# EAGLE design AP_AT42QT2120 (EAGLE 9.6.2)
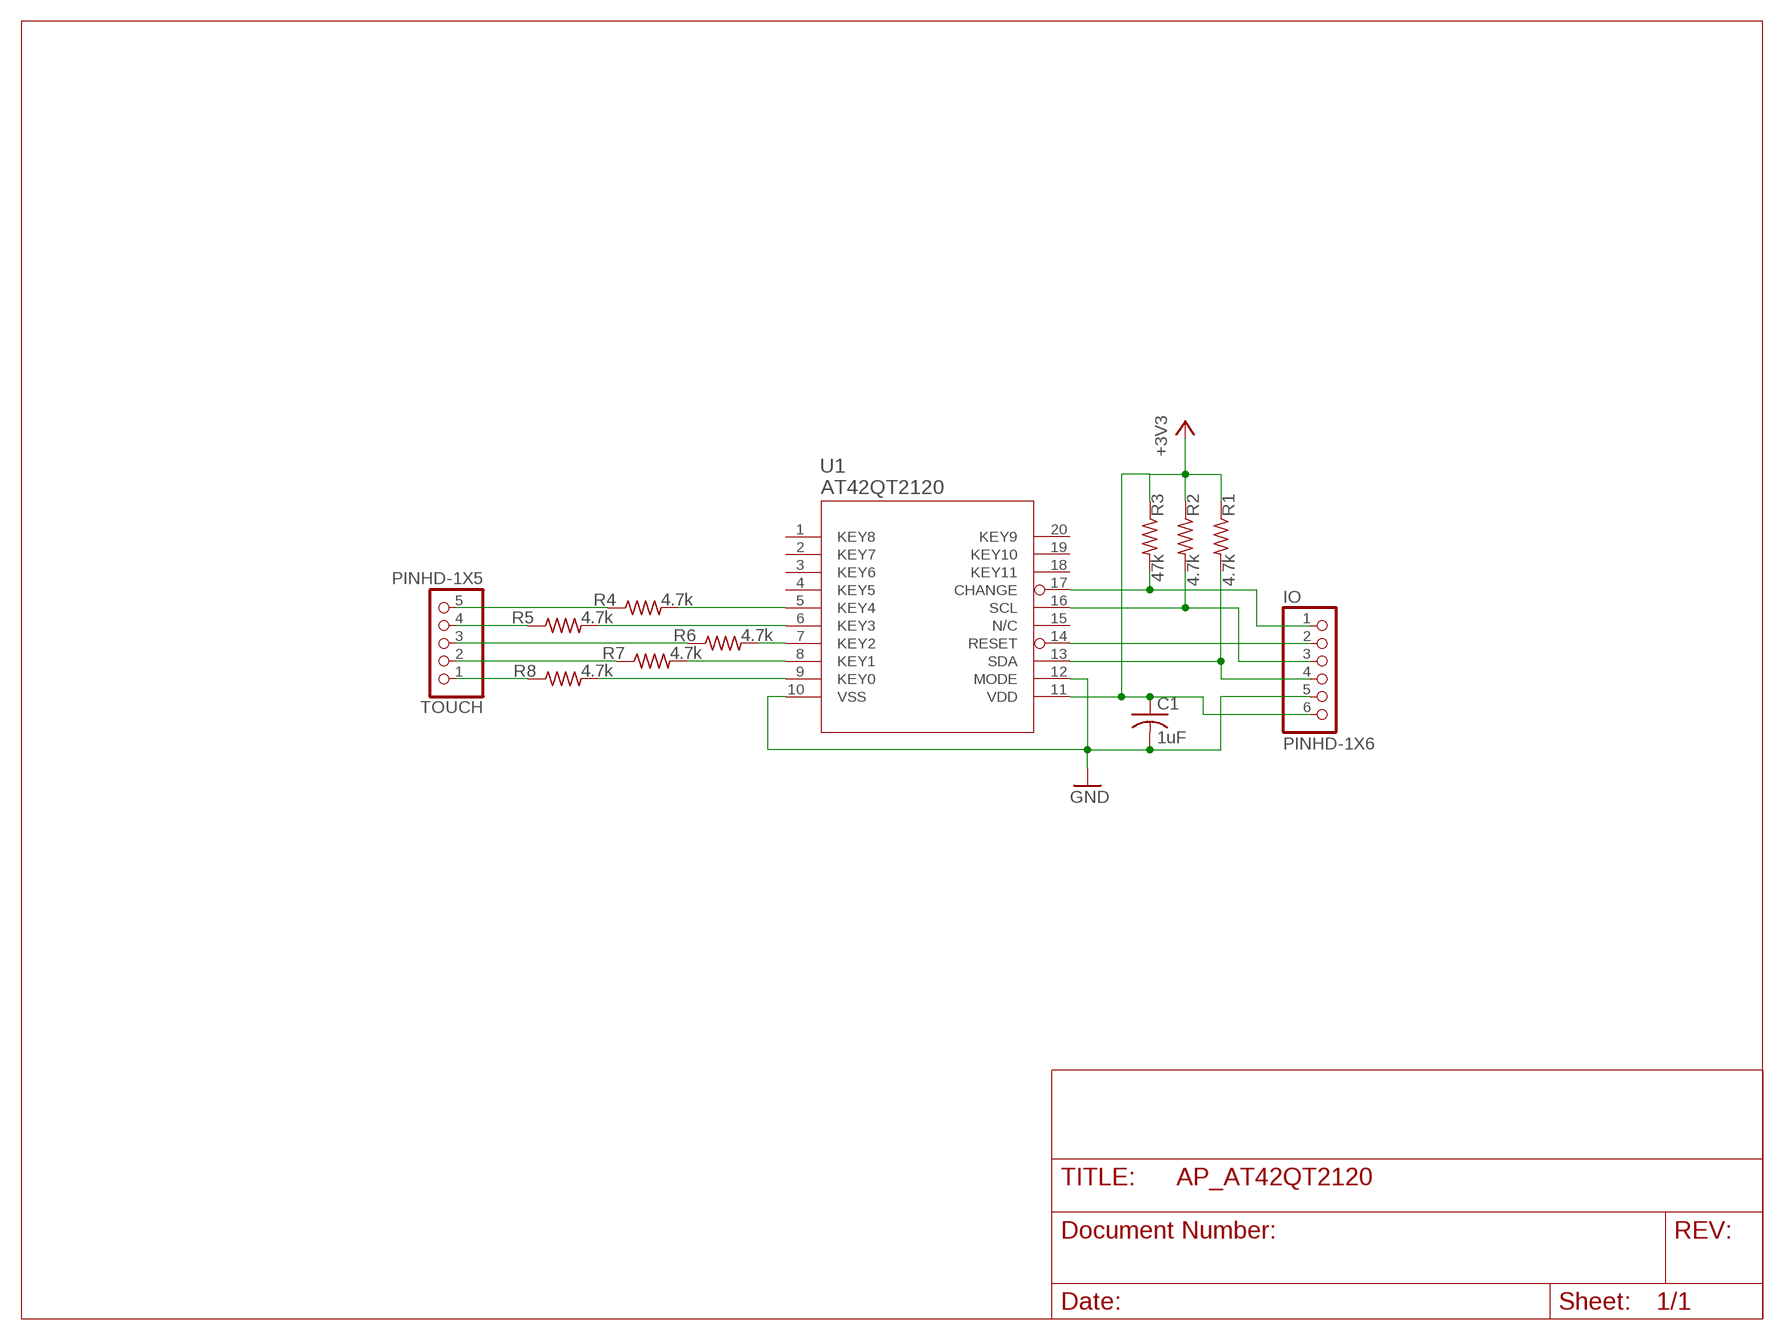
[diagram p0: schematic, sheet 1]

## Parts
C1  1uF  C-USC1206  [C1206]
IO  PINHD-1X6  [1X06]
R1  4.7k  R-US_R1206  [R1206]
R2  4.7k  R-US_R1206  [R1206]
R3  47k  R-US_R1206  [R1206]
R4  4.7k  R-US_R1206  [R1206]
R5  4.7k  R-US_R1206  [R1206]
R6  4.7k  R-US_R1206  [R1206]
R7  4.7k  R-US_R1206  [R1206]
R8  4.7k  R-US_R1206  [R1206]
TOUCH  PINHD-1X5  [1X05]
U1  AT42QT2120  AT42QT2120-SU  [SOIC20]

## Nets
+3V3: C1.1 IO.6 R1.1 R2.1 R3.1 U1.11(VDD)
GND: C1.2 IO.5 U1.10(VSS) U1.12(MODE)
N$1: IO.2 U1.14(RESET)
N$2: R5.1 TOUCH.4
N$5: R4.2 U1.5(KEY4)
N$6: R5.2 U1.6(KEY3)
N$7: R6.2 U1.7(KEY2)
N$8: R7.2 U1.8(KEY1)
N$9: R8.2 U1.9(KEY0)
N$10: R8.1 TOUCH.1
N$11: R7.1 TOUCH.2
N$12: R6.1 TOUCH.3
N$14: R4.1 TOUCH.5
N$25: IO.3 R2.2 U1.16(SCL)
N$26: IO.1 R3.2 U1.17(CHANGE)
N$27: IO.4 R1.2 U1.13(SDA)
Unconnected: U1.1(KEY8) U1.2(KEY7) U1.3(KEY6) U1.4(KEY5) U1.15(N/C) U1.18(KEY11) U1.19(KEY10) U1.20(KEY9)

## Library data of the parts
C1 = rcl:C-US: CAPACITOR, American symbol; SPICEPREFIX: C
IO = Connector:PINHD-1X6: PIN HEADER; CATEGORY: CONNECTOR; SUB-CATEGORY: PIN-HEADER
R1-R8 = rcl:R-US_: RESISTOR, American symbol; SPICEPREFIX: R
TOUCH = Connector:PINHD-1X5: PIN HEADER; CATEGORY: CONNECTOR; SUB-CATEGORY: PIN-HEADER
U1 = 2022-03-29_19-48-10_Library:AT42QT2120-SU: COMMS NAMES

## Board
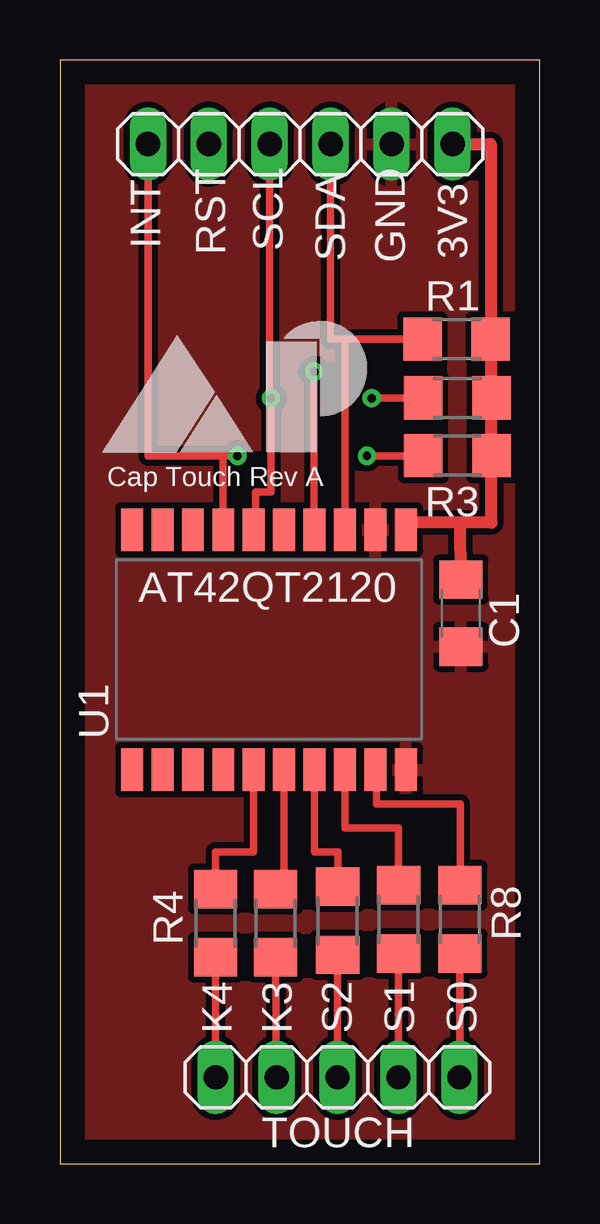
[diagram p1: board, top side]
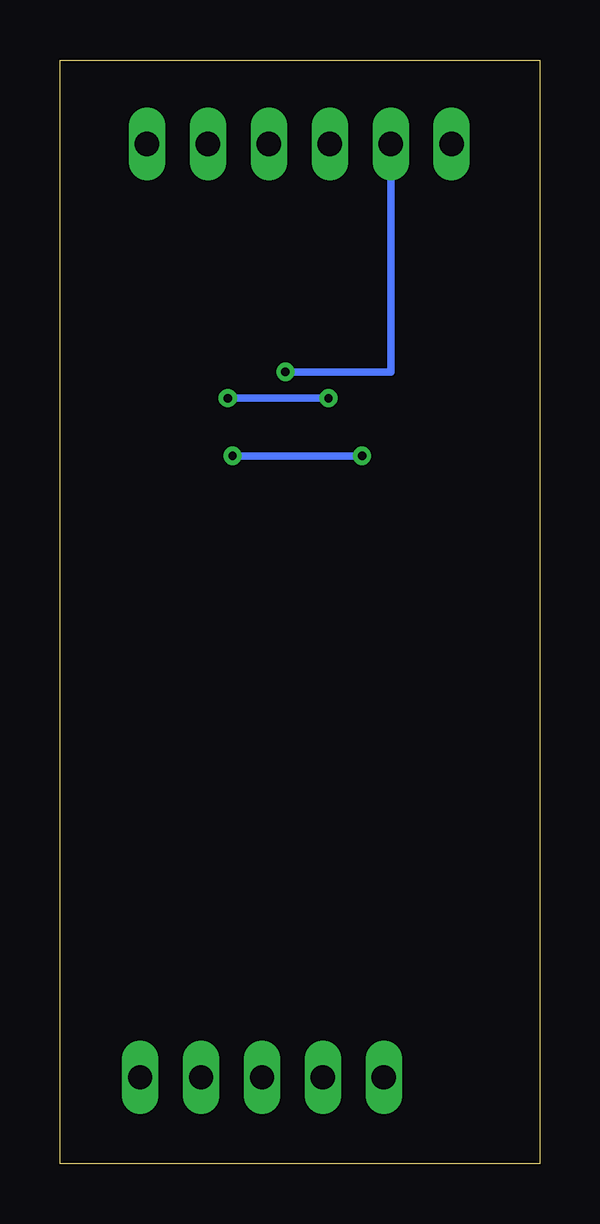
[diagram p2: board, bottom side, seen from below]

Size 20 x 46 mm. Coordinates in mm from the lower left corner, seen from the top.
Outline: 0,0 20,0 20,46 0,46 0,0
Copper layers (1*16): Top 0.035mm / dielectric 1.5mm / Bottom 0.035mm
Design rules "default": minimum track width 6mil, minimum drill 0.35mm, track to track 6mil, track to pad 6mil, pad to pad 6mil, via to via 6mil, smd to smd 6mil, copper to edge 40mil, drill to drill 6mil, minimum pad ring 10mil, minimum via ring 8mil, stop-mask expansion 4mil, vias tented up to drill 0mil, thermal gap 10mil

### Footprints (pad centres in the part's own frame; a part is rotated, then mirrored left to right if it is on the bottom)
C1206 = smd 1.6 x 1.8: 1 -1.4,0; 2 1.4,0
1X06 = drill 1.016 long: 1 -6.35,0; 2 -3.81,0; 3 -1.27,0; 4 1.27,0; 5 3.81,0; 6 6.35,0
R1206 = smd 1.6 x 1.803: 1 -1.422,0; 2 1.422,0
1X05 = drill 1.016 long: 1 -5.08,0; 2 -2.54,0; 3 0,0; 4 2.54,0; 5 5.08,0
SOIC20 = smd 1.778 x 0.914: 1 0,0; 2 0,-1.27; 3 0,-2.54; 4 0,-3.81; 5 0,-5.08; 6 0,-6.35; 7 0,-7.62; 8 0,-8.89; 9 0,-10.16; 10 0,-11.43; 11 10,-11.43; 12 10,-10.16; 13 10,-8.89; 14 10,-7.62; 15 10,-6.35; 16 10,-5.08; 17 10,-3.81; 18 10,-2.54; 19 10,-1.27; 20 10,0

### Placement (x,y rotation side)
C1  16.72,22.94 270 top
IO  10.02,42.49 0 top
R1  16.54,34.37 180 top
R2  16.57,31.91 180 top
R3  16.57,29.51 180 top
R4  6.49,10.02 90 top
R5  8.99,10.02 90 top
R6  11.58,10.12 90 top
R7  14.12,10.17 90 top
R8  16.68,10.17 90 top
TOUCH  11.57,3.59 180 top
U1  3,16.42 90 top

### Tracks (layer width: path | path; a pad name or v marks a point on that pad's centre or on a via)
+3V3
  Top 0.508: IO.6 17.96,42.49 R1.1 17.99,34.37 R2.1 | U1.11 14.73,26.72 16.7,26.72 | 16.7,26.72 17.99,26.72 R3.1 | 17.96,31.91 R2.1 | R3.1 R2.1 | R3.1 17.96,29.51 | C1.1 16.7,26.72
GND
  pour Top (isolate 0.254): 0,46 20.02,45.98 20.04,0.02 0,0
N$1  (via drill 0.35)
  Top 0.305: v10.6,33 10.6,26.42 U1.14
  Bottom 0.305: IO.2 6.21,33 v10.6,33
N$2
  Top 0.305: R5.1 TOUCH.4
N$5
  Top 0.305: U1.5 8.08,13 6.49,13 R4.2
N$6
  Top 0.305: U1.6 9.35,11.4 9.03,11.4 R5.2
N$7
  Top 0.305: U1.7 10.62,13 11.6,13 11.6,11.54 R6.2
N$8
  Top 0.305: U1.8 11.89,14 14.12,14 R7.2
N$9
  Top 0.2: 16.7,11.6 R8.2
  Top 0.305: 16.7,11.6 16.7,15 13.2,15 13.2,16.38 U1.9
N$10
  Top 0.305: R8.1 16.68,3.62 TOUCH.1
N$11
  Top 0.2: 14.12,3.59 TOUCH.2
  Top 0.305: R7.1 14.12,3.59
N$12
  Top 0.2: 11.58,3.59 TOUCH.3
  Top 0.305: R6.1 11.58,3.59
N$14
  Top 0.305: R4.1 TOUCH.5
N$25  (via drill 0.35)
  Top 0.305: U1.16 8.15,26.48 8.15,28 8.8,28 v8.8,31.9 8.75,31.95 IO.3 | R2.2 15.14,31.9 v13,31.9
  Top 0.61: 15.05,31.81 R2.2 15.05,32.01
  Bottom 0.305: v13,31.9 v8.8,31.9
N$26  (via drill 0.35)
  Top 0.305: R3.2 v12.8,29.5 | IO.1 3.67,29.5 6.81,29.5 | 6.81,29.5 v7.4,29.5 | U1.17 6.81,29.5
  Bottom 0.305: v12.8,29.5 v7.4,29.5
N$27
  Top 0.305: IO.4 11.29,34.37 11.89,34.37 | 11.89,34.37 U1.13 | R1.2 11.89,34.37

### Text on the board
tNames: INT | RST | SCL | SDA | GND | 3V3 | Cap Touch Rev A | K4 | K3 | S2 | S1 | S0